# EAGLE design flyingcap (EAGLE 4.13)
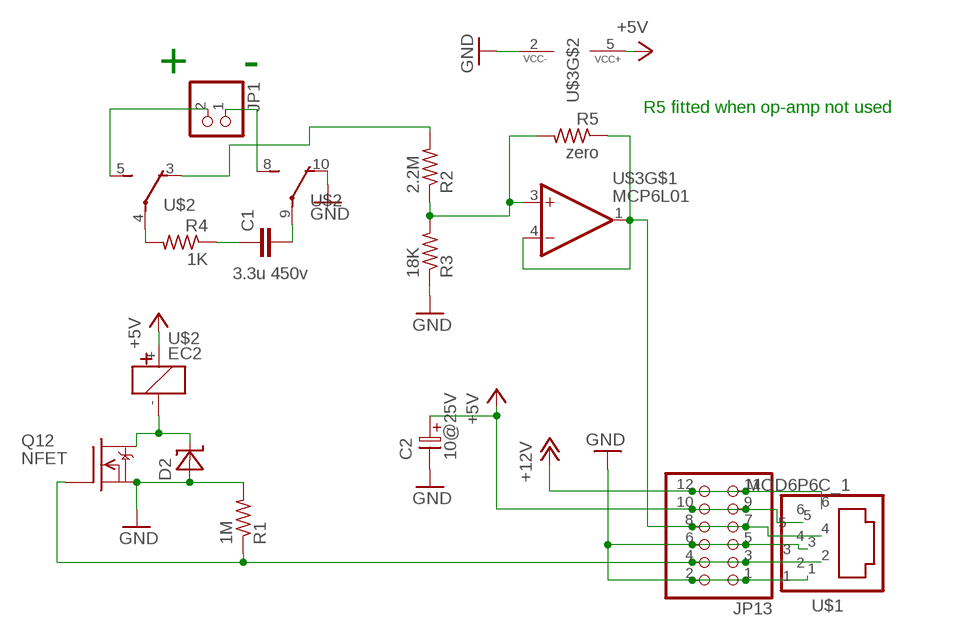
[diagram p0: schematic, sheet 1]

## Parts
C1  3.3u 450v  C22/10  [C22.5B10]
C2  10@25V  ELC-2,5L  [ES-2,5L]
D2  ZDIO-7,5  [D-7,5]
JP1  PINHD-1X2  [1X02]
JP13  PINHD-2X6  [2X06]
Q12  NFET  DMN3404L  [SOT-23]
R1  1M  R-US_R0603  [R0603]
R2  2.2M  R-US_R0603  [R0603]
R3  18K  R-US_R0603  [R0603]
R4  1K  R-US_R0603  [R0603]
R5  zero  R-US_R0603  [R0603]
U$1  MOD6P6C_1  [MOD6P6C_1]
U$2  EC2  [EC2]
U$3  MCP6L01  [SOT23-5]

## Nets
+5V: C2.1 JP13.9 JP13.10 U$1.5 U$2.+ U$3.5(VCC+)
+12V: JP13.11 JP13.12 U$1.6
B7BUF1: JP13.3 JP13.4 Q12.1(G) R1.1 U$1.2
DIV1: JP13.7 JP13.8 R5.1 U$1.4 U$3.1(OUT) U$3.4(-IN)
FLY+: R4.2 U$2.4(P)
FLY-: C1.2 U$2.9(P)
FLY_DIV: R2.1 R3.2 R5.2 U$3.3(+IN)
FLYX: R2.2 U$2.3(O)
GND: C2.2 D2.1(A) JP13.1 JP13.2 JP13.5 JP13.6 Q12.2(S) R1.2 R3.1 U$1.1 U$1.3 U$2.10(O) U$3.2(VCC-)
HV+: JP1.2 U$2.5(S)
HV-: JP1.1 U$2.8(S)
RC\: C1.1 R4.1
RYCOIL-: D2.2(K) Q12.3(D) U$2.-

## Notes on the sheet
- + | -
- R5 fitted when op-amp not used

## Library data of the parts
C1 = capacitor-wima:C: CAPACITOR naming: grid - package width
C2 = DEH:ELC-2,5L
D2 = DEH:ZDIO-7,5
JP1 = pinhead:PINHD-1X2: PIN HEADER
JP13 = pinhead:PINHD-2X6: PIN HEADER
Q12 = transistor-fet:DMN3404L
R1-R5 = rcl:R-US_: RESISTOR, American symbol
U$1 = DEH:MOD6P6C_1
U$2 = relay:EC2
U$3 = op-amp:MCP6L01

## Board
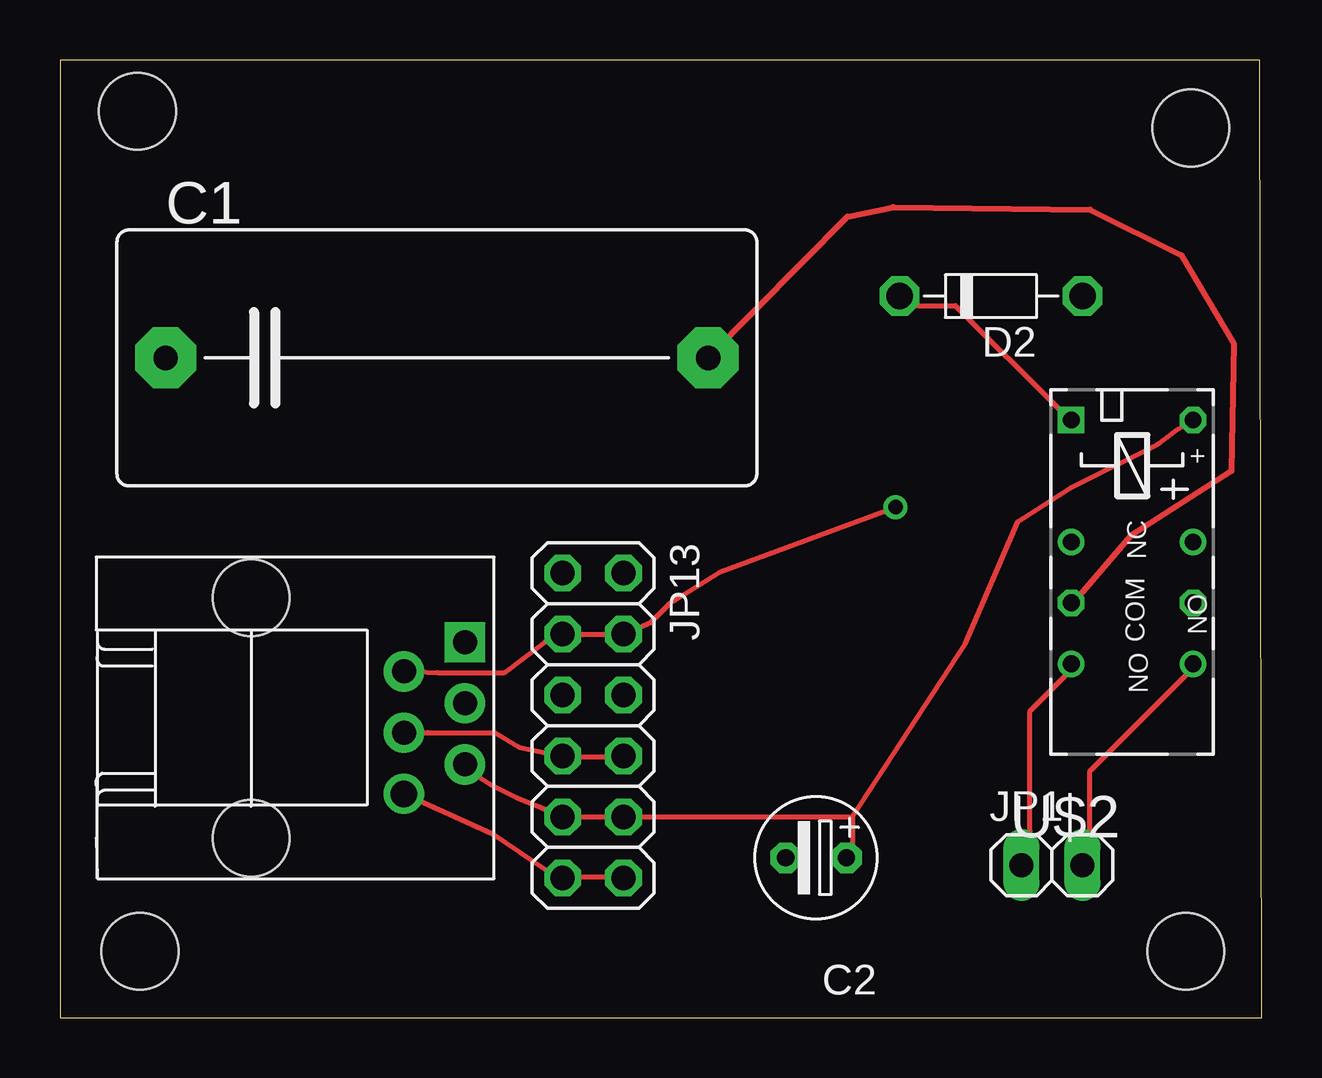
[diagram p1: board, top side]
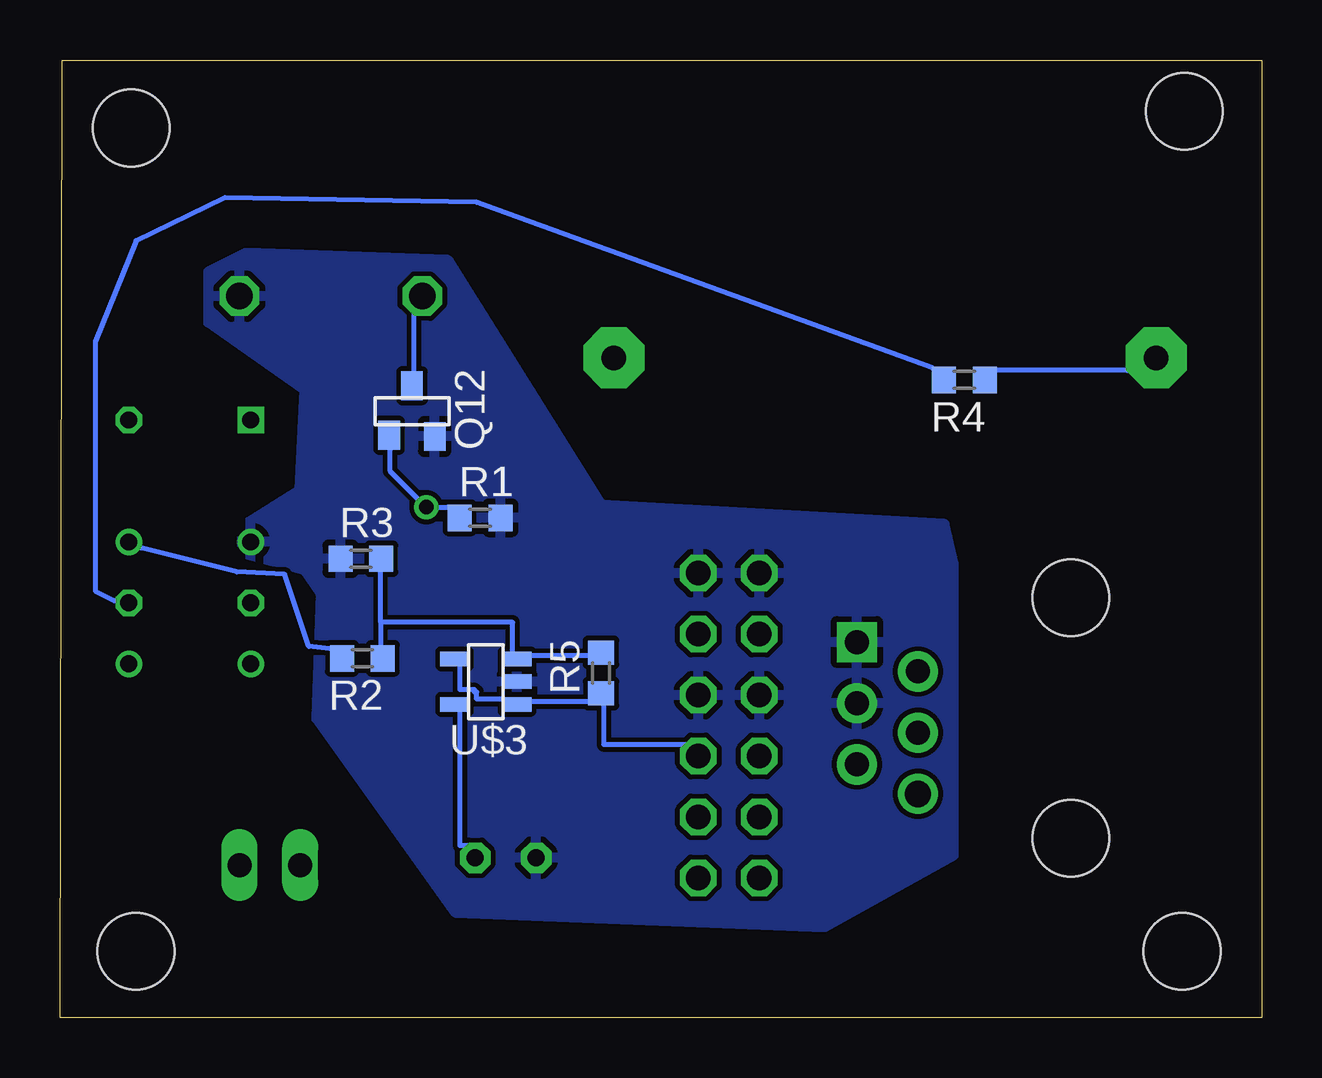
[diagram p2: board, bottom side, seen from below]

Size 50.1 x 39.9 mm. Coordinates in mm from the lower left corner, seen from the top.
Outline: 0,0 50.1,0 50,39.9 0,39.9 0,0
Copper layers (1*16): Top 0.2032mm / dielectric 1.5mm / Bottom 0.2032mm
Design rules "default": minimum track width 8mil, minimum drill 0.6mm, track to track 8mil, track to pad 8mil, pad to pad 8mil, via to via 8mil, smd to smd 8mil, copper to edge 8mil, drill to drill 8mil, minimum pad ring 8mil, minimum via ring 8mil, stop-mask expansion 4mil, vias tented up to drill 0mil, thermal gap 10mil
Holes 3.2 mm at 46.93,2.77 3.33,2.77 3.23,37.77 47.13,37.07

### Footprints (pad centres in the part's own frame; a part is rotated, then mirrored left to right if it is on the bottom)
C22.5B10 = drill 1.016 pad 2.54 octagon: 1 -11.303,0; 2 11.303,0
ES-2,5L = drill 0.711 pad 1.27 octagon: 1 0,0; 2 2.54,0
D-7,5 = drill 1.1 pad 1.6 octagon: 1 -3.81,0; 2 3.81,0
1X02 = drill 1 long: 1 -1.27,0; 2 1.27,0
2X06 = drill 1.016 octagon: 1 -6.35,-1.27; 2 -6.35,1.27; 3 -3.81,-1.27; 4 -3.81,1.27; 5 -1.27,-1.27; 6 -1.27,1.27; 7 1.27,-1.27; 8 1.27,1.27; 9 3.81,-1.27; 10 3.81,1.27; 11 6.35,-1.27; 12 6.35,1.27
SOT-23 = smd 0.9 x 1.2: 1 -1,-1.006; 2 0.9,-1.056; 3 -0.05,1.056
R0603 = smd 1 x 1.1: 1 -0.85,0; 2 0.85,0
MOD6P6C_1 = drill 1 pad 1.676 square: 1 -3.175,8.898 | drill 1 pad 1.676 round: 2 -1.951,6.358; 3 -0.627,8.898; 4 0.597,6.358; 5 1.921,8.898 | drill 1.1 pad 1.676 round: 6 3.145,6.358 | hole 3.2: -5.029,-0.01; 4.999,-0.01
EC2 = drill 0.7 round: 3 -1.27,2.54; 5 3.81,2.54; 8 3.81,-2.54; 10 -1.27,-2.54 | drill 0.7 octagon: 4 1.27,2.54; 9 1.27,-2.54; + -6.35,2.54 | drill 0.7 square: - -6.35,-2.54
SOT23-5 = smd 0.6 x 1.2: 1 -0.95,-1.306; 2 0,-1.306; 3 0.95,-1.306; 4 0.95,1.306; 5 -0.95,1.306

### Placement (x,y rotation side)
C1  15.71,27.49 0 top
C2  32.79,6.66 180 top
D2  38.81,30.06 180 top
JP1  41.35,6.35 0 top
JP13  22.22,12.17 270 top
Q12  35.38,25.27 0 bottom
R1  32.59,20.82 0 bottom
R2  37.5,14.97 180 bottom
R3  37.56,19.12 0 bottom
R4  12.4,26.57 180 bottom
R5  27.55,14.36 90 bottom
U$1  7.98,12.47 270 top
U$2  44.69,18.55 270 top
U$3  32.35,14 90 bottom

### Tracks (layer width: path | path; a pad name or v marks a point on that pad's centre or on a via)
+5V
  Top 0.203: U$1.5 17.23,10.17 18.03,9.67 19.03,9.17 20.03,8.77 JP13.9 21.63,8.37 22.73,8.37 JP13.10 24.23,8.37 33.03,8.37 | 33.03,8.37 33.03,7.27 C2.1 | 33.03,8.37 37.73,15.57 39.93,20.67 42.13,22.07 45.73,23.87 46.53,24.47 U$2.+
  Bottom 0.203: U$3.5 33.43,12.77 33.43,7.17 33.13,7.17 C2.1
+12V
  Top 0.203: JP13.12 22.73,5.87 21.63,5.87 JP13.11 20.23,6.17 18.03,7.67 15.13,8.97 U$1.6
B7BUF1  (via drill 0.6)
  Top 0.203: v34.83,21.27 27.53,18.57 25.43,17.27 24.63,16.47 JP13.4 22.73,15.97 21.63,15.97 JP13.3 20.23,15.67 18.53,14.37 15.73,14.37 U$1.2
  Bottom 0.203: R1.1 33.93,21.27 v34.83,21.27 36.33,22.77 36.33,23.67 Q12.1
DIV1
  Top 0.203: JP13.8 22.73,10.87 21.63,10.87 JP13.7 19.13,11.27 18.13,11.87 15.33,11.87 U$1.4
  Bottom 0.203: U$3.4 33.43,14.67 33.43,13.67 32.83,13.67 32.83,13.57 32.73,13.57 32.73,13.27 31.63,13.27 U$3.1 30.53,13.17 28.03,13.17 R5.1 27.43,13.07 27.43,11.37 24.03,11.37 JP13.8
FLY+
  Bottom 0.203: R4.2 13.73,27.07 32.73,33.97 43.23,34.17 46.93,32.37 48.63,28.17 48.63,17.77 47.83,17.37 U$2.4
FLY-
  Top 0.254: C1.2 32.83,33.37 34.73,33.77 42.93,33.67 46.73,31.77 48.93,28.07 48.83,22.77 44.63,20.07 42.13,17.17 U$2.9
FLY_DIV
  Bottom 0.203: R5.2 28.03,15.07 30.53,15.07 U$3.3 31.23,15.17 31.23,16.47 36.73,16.47 | 36.73,16.47 36.73,18.67 R3.2 | 36.73,16.47 36.73,15.47 R2.1
FLYX
  Bottom 0.203: R2.2 38.83,15.37 39.73,15.47 40.73,18.47 42.73,18.57 46.73,19.57 U$2.3
GND
  pour Bottom: 13.23,20.57 27.53,21.37 33.93,31.57 42.33,31.87 43.93,31.07 43.93,28.97 39.93,26.17 40.13,21.97 42.53,20.47 42.53,19.37 39.93,18.67 39.23,17.67 39.43,12.47 33.63,4.37 18.23,3.77 12.83,6.77 12.83,18.87
HV+
  Top 0.203: U$2.5 46.93,14.27 42.93,10.27 42.93,7.77 JP1.2
HV-
  Top 0.203: U$2.8 41.93,14.27 40.43,12.77 40.43,7.77 JP1.1
RC\
  Bottom 0.203: R4.1 11.13,26.97 5.63,26.97 C1.1
RYCOIL-
  Top 0.203: U$2.- 41.63,25.37 37.33,29.67 35.73,29.67 D2.2
  Bottom 0.203: Q12.3 35.33,26.87 35.33,29.27 D2.2